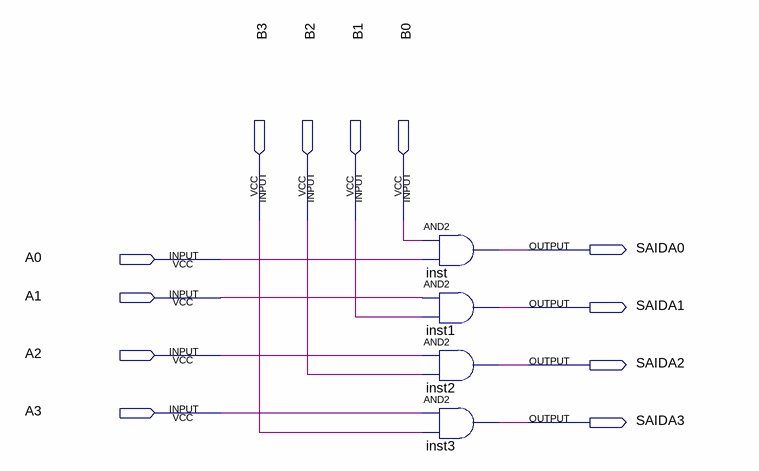
[diagram p0: schematic sheet]
// Quartus schematic e.bdf as structural Verilog: 4 symbols, 12 pins
module e (
  input  B3,
  input  B2,
  input  B1,
  input  B0,
  input  A0,
  input  A1,
  input  A2,
  input  A3,
  output SAIDA0,
  output SAIDA1,
  output SAIDA2,
  output SAIDA3
);

  and inst (SAIDA0, B0, A0);
  and inst1 (SAIDA1, A1, B1);
  and inst2 (SAIDA2, A2, B2);
  and inst3 (SAIDA3, A3, B3);
endmodule
